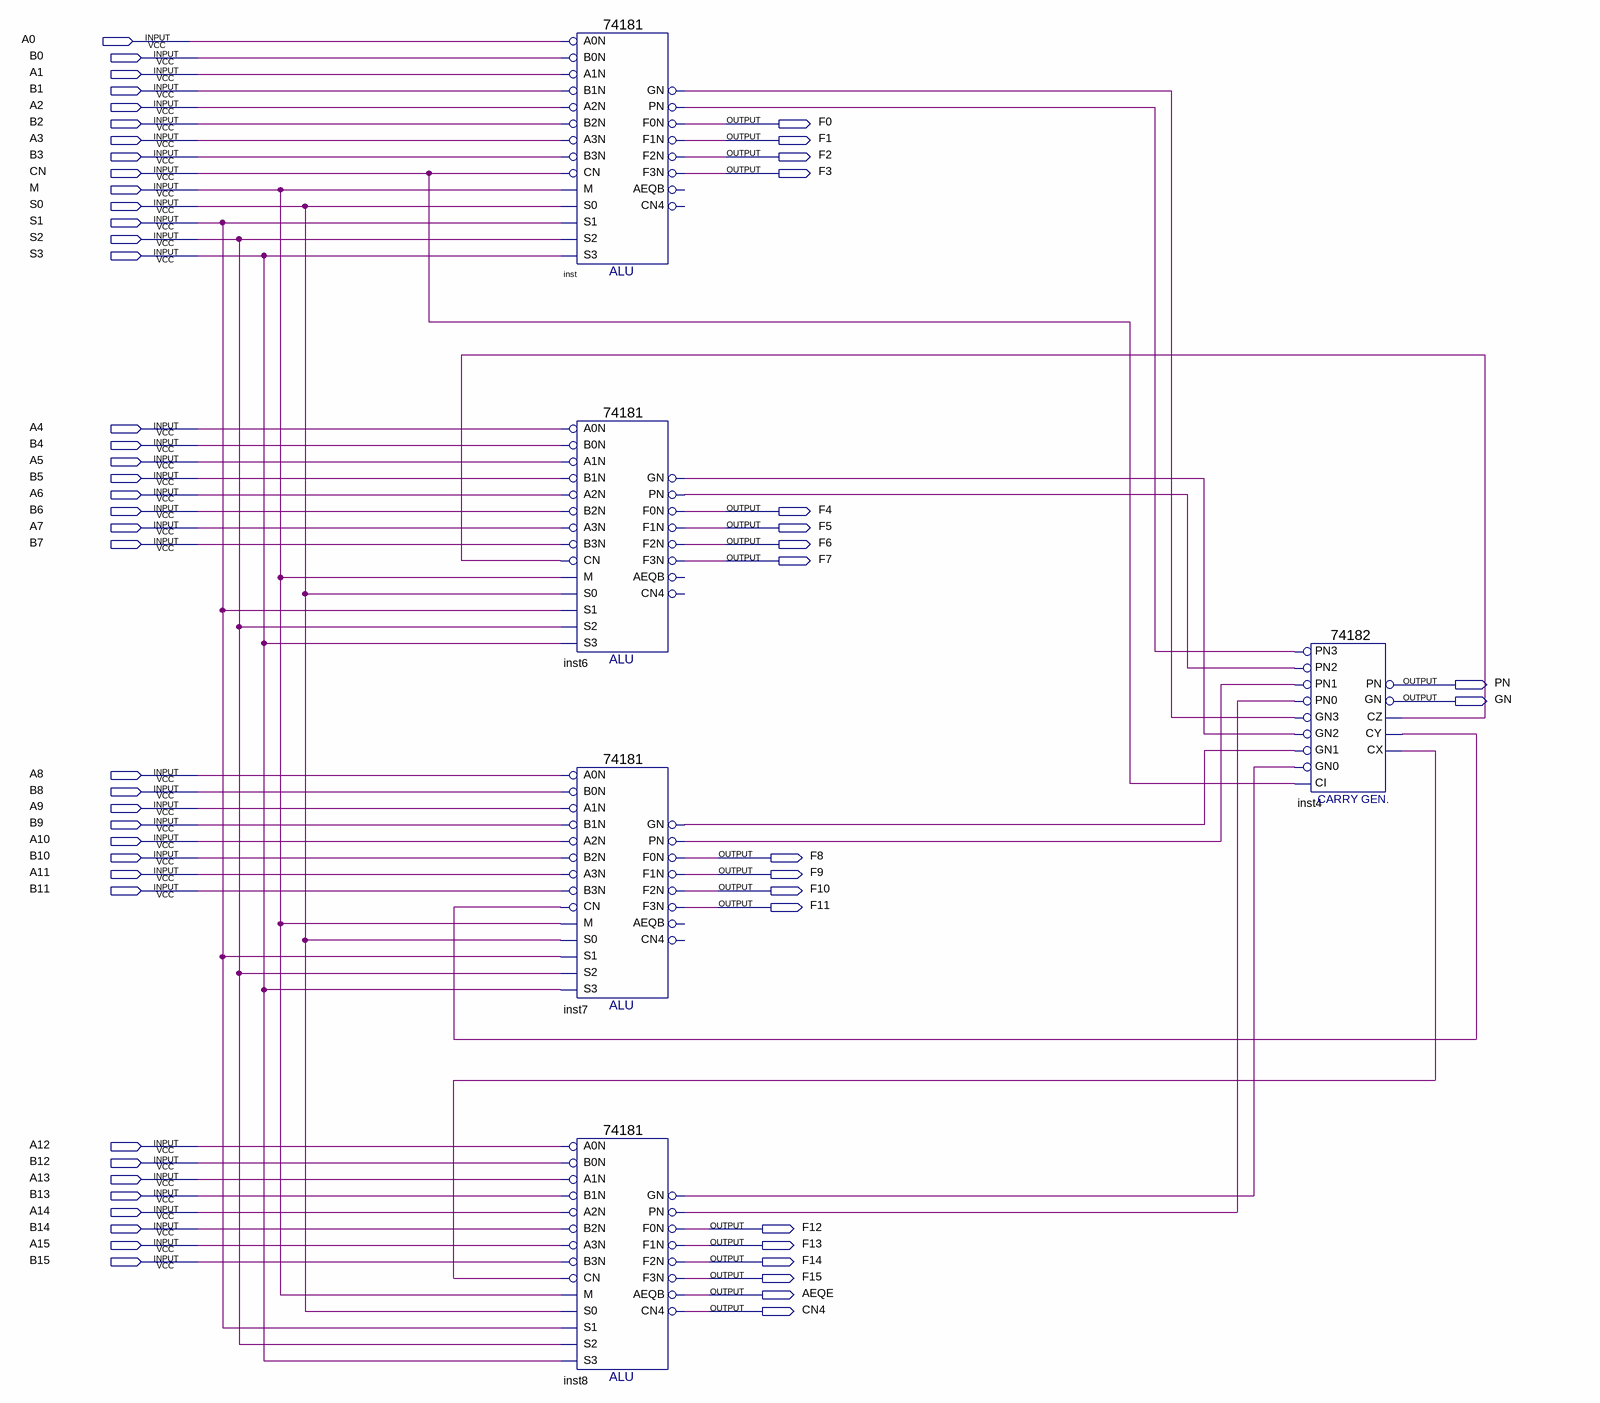
[diagram p0: schematic sheet]
// Quartus schematic A274181.bdf as structural Verilog: 5 symbols, 58 pins
module A274181 (
  input  A0,
  input  B0,
  input  A1,
  input  B1,
  input  A2,
  input  B2,
  input  A3,
  input  B3,
  input  CN,
  input  M,
  input  S0,
  input  S1,
  input  S2,
  input  S3,
  input  A4,
  input  B4,
  input  A5,
  input  B5,
  input  A6,
  input  B6,
  input  A7,
  input  B7,
  input  A8,
  input  B8,
  input  A9,
  input  B9,
  input  A10,
  input  B10,
  input  A11,
  input  B11,
  input  A12,
  input  B12,
  input  A13,
  input  B13,
  input  A14,
  input  B14,
  input  A15,
  input  B15,
  output F0,
  output F1,
  output F2,
  output F3,
  output F4,
  output F5,
  output F6,
  output F7,
  output PN,
  output GN,
  output F8,
  output F9,
  output F10,
  output F11,
  output F12,
  output F13,
  output F14,
  output F15,
  output AEQE,
  output CN4
);

  wire inst4_cx, inst4_cy, inst4_cz, inst6_gn, inst6_pn, inst7_gn, inst7_pn, inst8_gn, inst8_pn, inst_gn,
       inst_pn;

  \74181  inst (
    .B0N(B0), .A0N(A0), .A1N(A1), .B1N(B1), .A3N(A3), .B2N(B2), .A2N(A2), .M(M), .CN(CN), .B3N(B3), .S2(S2),
    .S1(S1), .S0(S0), .S3(S3), .PN(inst_pn), .GN(inst_gn), .F3N(F3), .F1N(F1), .F0N(F0), .F2N(F2));  // open: AEQB, CN4
  \74181  inst6 (
    .B0N(B4), .A0N(A4), .A1N(A5), .B1N(B5), .A3N(A7), .B2N(B6), .A2N(A6), .M(M), .CN(inst4_cz), .B3N(B7),
    .S2(S2), .S1(S1), .S0(S0), .S3(S3), .PN(inst6_pn), .GN(inst6_gn), .F3N(F7), .F1N(F5), .F0N(F4), .F2N(F6));  // open: AEQB, CN4
  \74181  inst7 (
    .B0N(B8), .A0N(A8), .A1N(A9), .B1N(B9), .A3N(A11), .B2N(B10), .A2N(A10), .M(M), .CN(inst4_cy), .B3N(B11),
    .S2(S2), .S1(S1), .S0(S0), .S3(S3), .PN(inst7_pn), .GN(inst7_gn), .F3N(F11), .F1N(F9), .F0N(F8), .F2N(F10));  // open: AEQB, CN4
  \74181  inst8 (
    .B0N(B12), .A0N(A12), .A1N(A13), .B1N(B13), .A3N(A15), .B2N(B14), .A2N(A14), .M(M), .CN(inst4_cx),
    .B3N(B15), .S2(S2), .S1(S1), .S0(S0), .S3(S3), .PN(inst8_pn), .GN(inst8_gn), .F3N(F15), .F1N(F13),
    .F0N(F12), .AEQB(AEQE), .CN4(CN4), .F2N(F14));
  \74182  inst4 (
    .PN2(inst6_pn), .GN2(inst6_gn), .GN3(inst_gn), .PN3(inst_pn), .CI(CN), .PN1(inst7_pn), .PN0(inst8_pn),
    .GN1(inst7_gn), .GN0(inst8_gn), .CY(inst4_cy), .PN(PN), .CX(inst4_cx), .CZ(inst4_cz), .GN(GN));
endmodule
